# Altium schematic sheet MCU.SchDoc
size A4; SheetNumber: 3; SheetTotal: 3
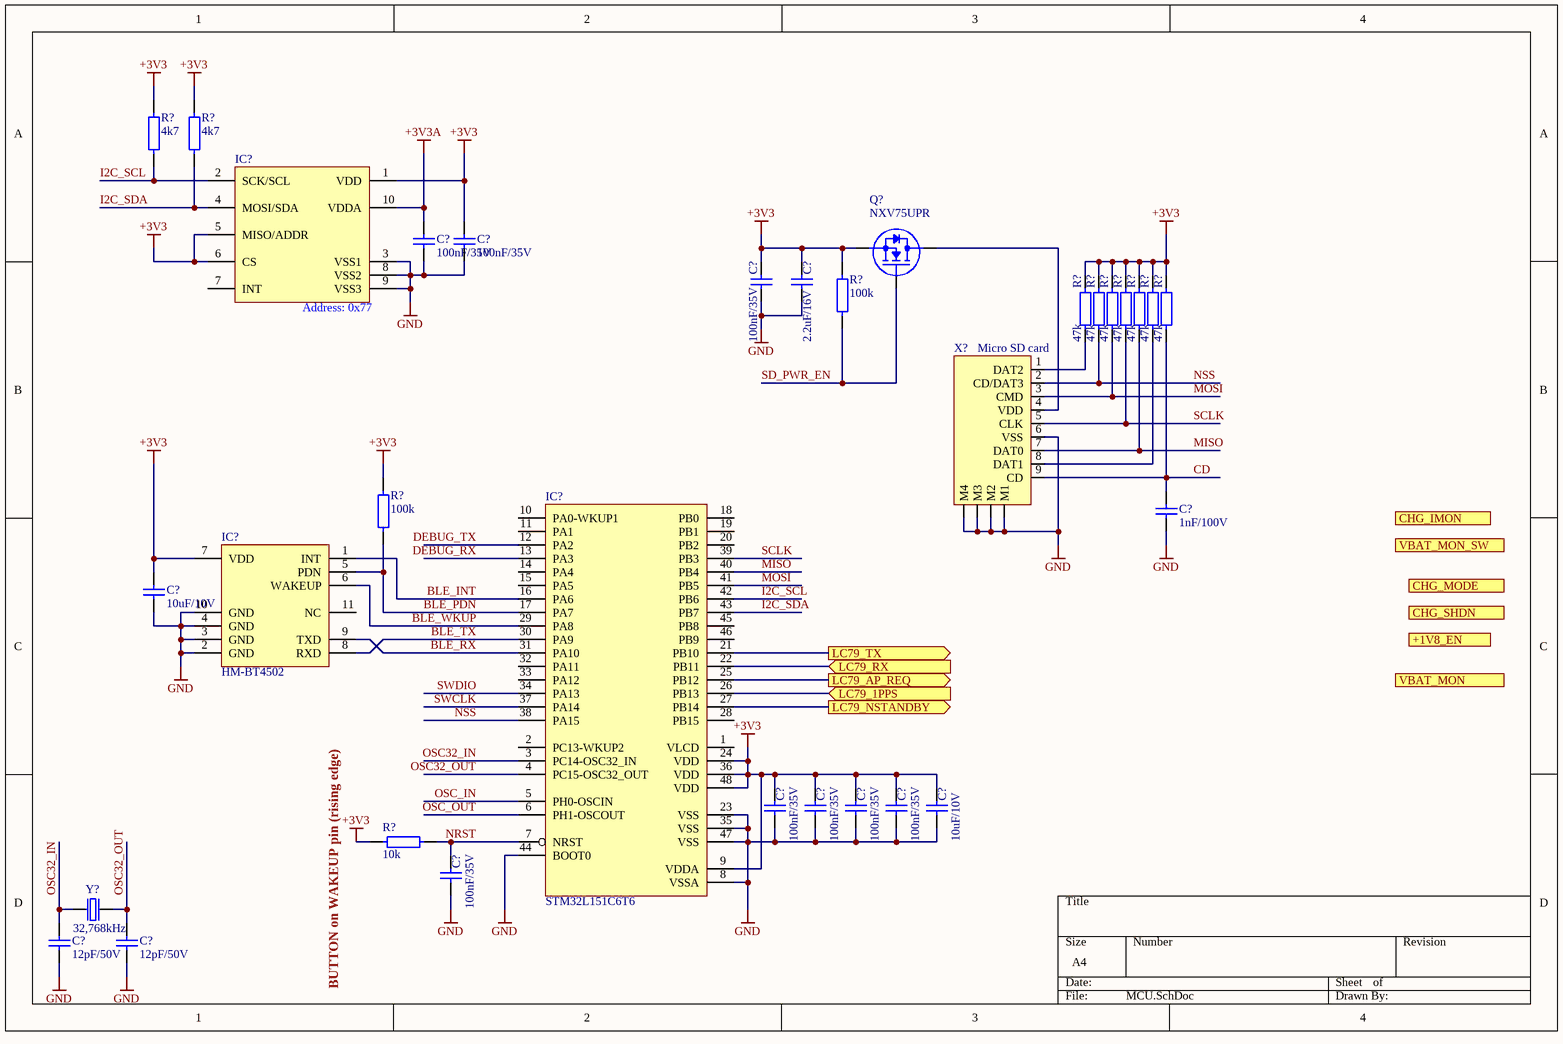
[diagram p0: MCU.SchDoc]

## Parts
(Parts that share a designator on the sheet are numbered #1, #2 ... from top to bottom, then left to right.)
C?#1  100nF/35V  [C0603]
C?#2  100nF/35V  [C0603]
C?#3  100nF/35V  [C0603]
C?#4  2.2uF/16V  [C0603]
C?#5  1nF/100V  [C0603]
C?#6  10uF/10V  [C0603]
C?#7  100nF/35V  [C0603]
C?#8  100nF/35V  [C0603]
C?#9  100nF/35V  [C0603]
C?#10  100nF/35V  [C0603]
C?#11  10uF/10V  [C0603]
C?#12  100nF/35V  [C0603]
C?#13  12pF/50V  [C0603]
C?#14  12pF/50V  [C0603]
IC?#1  (no value)  [LGA10]
IC?#2  STM32L151C6T6  [LQFP48]
IC?#3  HM-BT4502  [HM-BT450X]
Q?  NXV75UPR  [SOT23-3]
R?#1  4k7  [R0603]
R?#2  4k7  [R0603]
R?#3  100k  [R0603]
R?#4  47k  [R0603]
R?#5  47k  [R0603]
R?#6  47k  [R0603]
R?#7  47k  [R0603]
R?#8  47k  [R0603]
R?#9  47k  [R0603]
R?#10  47k  [R0603]
R?#11  100k  [R0603]
R?#12  10k  [r0603]
X?  Micro SD card  [MicroSD pull-slot]
Y?  32,768kHz  [FC135]

## Ports
+1V8_EN (in), CHG_IMON (out), CHG_MODE (out), CHG_SHDN (in), LC79_1PPS (in), LC79_AP_REQ (out), LC79_NSTANDBY (out), LC79_RX (in), LC79_TX (out), VBAT_MON (out), VBAT_MON_SW (in)

## Nets
+3V3: C?#2.2 C?#3.2 C?#4.2 C?#6.2 C?#7.2 C?#8.2 C?#9.2 C?#10.2 C?#11.2 IC?#1.1(VDD) IC?#1.5(MISO/ADDR) IC?#1.6(CS) IC?#2.9(VDDA) IC?#2.24(VDD) IC?#2.36(VDD) IC?#2.48(VDD) IC?#3.7(VDD) Q?.2(S) R?#1.1 R?#2.1 R?#3.1 R?#4.2 R?#5.2 R?#6.2 R?#7.2 R?#8.2 R?#9.2 R?#10.2 R?#11.2 R?#12.1
+3V3A: C?#1.2 IC?#1.10(VDDA)
GND: C?#1.1 C?#2.1 C?#3.1 C?#4.1 C?#5.1 C?#6.1 C?#7.1 C?#8.1 C?#9.1 C?#10.1 C?#11.1 C?#12.1 C?#13.1 C?#14.1 IC?#1.3(VSS1) IC?#1.8(VSS2) IC?#1.9(VSS3) IC?#2.8(VSSA) IC?#2.23(VSS) IC?#2.35(VSS) IC?#2.44(BOOT0) IC?#2.47(VSS) IC?#3.2(GND) IC?#3.3(GND) IC?#3.4(GND) IC?#3.10(GND) X?.6(VSS) X?.M1 X?.M2 X?.M3 X?.M4
BLE_INT: IC?#2.16(PA6) IC?#3.1(INT)
BLE_PDN: IC?#2.17(PA7) IC?#3.5(PDN) R?#11.1
BLE_RX: IC?#2.31(PA10) IC?#3.9(TXD)
BLE_TX: IC?#2.30(PA9) IC?#3.8(RXD)
BLE_WKUP: IC?#2.29(PA8) IC?#3.6(WAKEUP)
CD: C?#5.2 R?#10.1 X?.9(CD)
DEBUG_RX: IC?#2.13(PA3)
DEBUG_TX: IC?#2.12(PA2)
I2C_SCL: IC?#1.2(SCK/SCL) IC?#2.42(PB6) R?#1.2
I2C_SDA: IC?#1.4(MOSI/SDA) IC?#2.43(PB7) R?#2.2
LC79_1PPS: IC?#2.26(PB13) ; port LC79_1PPS
LC79_AP_REQ: IC?#2.25(PB12) ; port LC79_AP_REQ
LC79_NSTANDBY: IC?#2.27(PB14) ; port LC79_NSTANDBY
LC79_RX: IC?#2.22(PB11) ; port LC79_RX
LC79_TX: IC?#2.21(PB10) ; port LC79_TX
MISO: IC?#2.40(PB4) R?#8.1 X?.7(DAT0)
MOSI: IC?#2.41(PB5) R?#6.1 X?.3(CMD)
NRST: C?#12.2 IC?#2.7(NRST) R?#12.2
NSS: IC?#2.38(PA15) R?#5.1 X?.2(CD/DAT3)
OSC32_IN: C?#13.2 IC?#2.3(PC14-OSC32_IN) Y?.1
OSC32_OUT: C?#14.2 IC?#2.4(PC15-OSC32_OUT) Y?.2
OSC_IN: IC?#2.5(PH0-OSCIN)
OSC_OUT: IC?#2.6(PH1-OSCOUT)
SCLK: IC?#2.39(PB3) R?#7.1 X?.5(CLK)
SD_PWR_EN: Q?.1(G) R?#3.2
SWCLK: IC?#2.37(PA14)
SWDIO: IC?#2.34(PA13)
NetQ?_3: Q?.3(D) X?.4(VDD)
NetR?#4_1: R?#4.1 X?.1(DAT2)
NetR?#9_1: R?#9.1 X?.8(DAT1)

Not connected (* = marked no-connect by the designer): IC?#1 7(INT); IC?#2 1(VLCD) 2(PC13-WKUP2) 10(PA0-WKUP1) 11(PA1) 14(PA4) 15(PA5) 18(PB0) 19(PB1) 20(PB2) 28(PB15) 32(PA11) 33(PA12) 45(PB8) 46(PB9); IC?#3 11(NC)

## Notes on the sheet
- (near IC?#1) Address: 0x77
- (near R?#12) BUTTON on WAKEUP pin (rising edge)

## Library data of the parts
C?#1-C?#3 C?#7-C?#10 C?#12 = 06035G104ZAT2A: CERAMIC CAPACITOR, 0.1UF, 50V, Y5V, +80,-20%, 0603, FULL REEL; Product Range:-; Capacitance:0.1 F; Capacitance Tolerance:+80%, -20%; Dielectric Characteristic:Y5V; Voltage Rating:50V; Ceramic Capacitor Case:0603 [1608 Metric] ;RoHS Compliant: Yes; Manufacturer: Kyocera AVX; Capacitance: 100nF; Tolerance: 80%; Supplier 1: Farnell; Supplier Part Number 1: 2332660; Manufacturer Part Number: 06035G104ZAT2A; RoHS: Yes; Category: Ceramic Capacitors; Stock 1: 29140; Pricing 1: 10=0,03250, 100=0,02120, 500=0,01780, 1000=0,01420, 2000=0,01220 (GBP); Mount: Surface Mount,PCB; Case/Package: 0603; Number of Pins: 2; Case Code (Metric): 1608; Case Code (Imperial): 0603; Contact Plating: Tin,Matte; Dielectric Material: Ceramic; Min Operating Temperature: -30°C; Max Operating Temperature: 85°C; Dielectric: Y5V; Packaging: Tape and Reel; Voltage Rating (DC): 50V; Voltage Rating: 50V; Package Quantity: 1; Termination: SMD/SMT; Voltage: 50V; Series: -; Construction: Flat; Length: 1.6mm; Width: 0.032inch; Height: 0.63mm; Depth: 0.81mm; Thickness: 0.035inch; Radiation Hardening: No; REACH SVHC: No SVHC; Lead Free: Lead Free; RoHS Compliant: Yes; ComponentLink1URL: https://datasheet.ciiva.com/2987/cy5v-2987860.pdf?src-supplier=Avnet; ComponentLink1Description: https://datasheet.ciiva.com/2987/cy5v-2987860.pdf?src-supplier=Avnet; ComponentLink2URL: https://datasheet.ciiva.com/16359/cy5v-16359895.pdf?src-supplier=Future+Electronics; ComponentLink2Description: https://datasheet.ciiva.com/16359/cy5v-16359895.pdf?src-supplier=Future+Electronics; ComponentLink3URL: https://datasheet.ciiva.com/28613/578190-28613048.pdf?src-supplier=Element14; ComponentLink3Description: https://datasheet.ciiva.com/28613/578190-28613048.pdf?src-supplier=Element14; ComponentLink4URL: https://datasheet.ciiva.com/151/cy5v-151545.pdf?src-supplier=Digi-Key; ComponentLink4Description: https://datasheet.ciiva.com/151/cy5v-151545.pdf?src-supplier=Digi-Key; ComponentLink5URL: https://datasheet.ciiva.com/151/cy5v-151546.pdf?src-supplier=Digi-Key; ComponentLink5Description: https://datasheet.ciiva.com/151/cy5v-151546.pdf?src-supplier=Digi-Key; ComponentLink6URL: https://datasheet.ciiva.com/151/cy5v-151547.pdf?src-supplier=Digi-Key; ComponentLink6Description: https://datasheet.ciiva.com/151/cy5v-151547.pdf?src-supplier=Digi-Key; ComponentLink7URL: https://datasheet.ciiva.com/11499/cy5v-11499710.pdf?src-supplier=Avnet; ComponentLink7Description: https://datasheet.ciiva.com/11499/cy5v-11499710.pdf?src-supplier=Avnet; Supplier 2: Mouser; Supplier Part Number 2: 581-06035G104Z; Stock 2: 97036; Pricing 2: 1=0,09000, 10=0,03300, 50=0,03300, 100=0,02700, 1000=0,01600, 10000=0,01000 (USD); Supplier 3: Digi-Key; Supplier Part Number 3: 478-3724-6-ND; Stock 3: 629269; Pricing 3: 1=0,10000, 10=0,05900, 50=0,03220, 100=0,02640, 500=0,01882, 1000=0,01479 (USD)
C?#4 = C1608X5R1C225K080AB: TDK - C1608X5R1C225K080AB - SMD Multilayer Ceramic Capacitor, 2.2 µF, 16 V, 0603 [1608 Metric], ± 10%, X5R, C Series TDK; Capacitance: 2.2uF; Voltage Rating: 16V; Manufacturer: TDK; Manufacturer Part Number: C1608X5R1C225K080AB; RoHS: Yes; Category: Ceramic Capacitors; Stock 1: 107257; Pricing 1: 1=0,19000, 10=0,12900, 50=0,07760, 100=0,06560, 500=0,04484, 1000=0,03968 (USD); Mount: Surface Mount; Case/Package: 0603; Case Code (Metric): 1608; Case Code (Imperial): 0603; Dielectric Material: Ceramic; Weight: 7.1E-05oz; Min Operating Temperature: -55°C; Max Operating Temperature: 85°C; Tolerance: 10%; Dielectric: X5R; Packaging: Tape and Reel; Voltage Rating (DC): 16V; Termination: SMD/SMT; Package Quantity: 1; Resistor Type: Ceramic; Construction: Flat; Voltage: 16V; Series: C; Length: 1.6mm; Width: 0.031inch; Height: 0.8mm; Depth: 0.8mm; Thickness: 0.035inch; Radiation Hardening: No; REACH SVHC: No SVHC; Lead Free: Lead Free; RoHS Compliant: Yes; ComponentLink1URL: https://datasheet.ciiva.com/6251/tdkmlcccaprange-6251142.pdf?src-supplier=Digi-Key; ComponentLink1Description: https://datasheet.ciiva.com/6251/tdkmlcccaprange-6251142.pdf?src-supplier=Digi-Key; ComponentLink2URL: https://datasheet.ciiva.com/28577/mlcc-commercial-general-en-28577144.pdf?src-supplier=Element14; ComponentLink2Description: https://datasheet.ciiva.com/28577/mlcc-commercial-general-en-28577144.pdf?src-supplier=Element14; ComponentLink3URL: https://datasheet.ciiva.com/26285/13mlcc-commercial-general-en-26285227.pdf?src-supplier=Onlinecomponents.com; ComponentLink3Description: https://datasheet.ciiva.com/26285/13mlcc-commercial-general-en-26285227.pdf?src-supplier=Onlinecomponents.com; ComponentLink4URL: https://datasheet.ciiva.com/22725/1913358-22725516.pdf?src-supplier=Element14; ComponentLink4Description: https://datasheet.ciiva.com/22725/1913358-22725516.pdf?src-supplier=Element14; ComponentLink5URL: https://datasheet.ciiva.com/17487/e412-c-17487517.pdf?src-supplier=Avnet+Europe; ComponentLink5Description: https://datasheet.ciiva.com/17487/e412-c-17487517.pdf?src-supplier=Avnet+Europe; ComponentLink6URL: https://datasheet.ciiva.com/23802/1796654-23802766.pdf?src-supplier=Newark; ComponentLink6Description: https://datasheet.ciiva.com/23802/1796654-23802766.pdf?src-supplier=Newark; ComponentLink7URL: https://datasheet.ciiva.com/7975/1796654-7975071.pdf?src-supplier=Element14; ComponentLink7Description: https://datasheet.ciiva.com/7975/1796654-7975071.pdf?src-supplier=Element14; Supplier 1: Digi-Key; Supplier 2: Mouser; Supplier 3: Farnell; Supplier Part Number 1: 445-5157-1-ND; Supplier Part Number 2: 810-C1608X5R1C225K-4; Supplier Part Number 3: 2211169
C?#5 = 06031C102KAT2A: Cap MLCC SMD 0603 100V X7R 1000pF 10% Commercial Ti/Sn Plated 7"T/R; Manufacturer: Kyocera AVX; Dielectric Material: Ceramic; Capacitance: 1nF; Insulation Resistance: 100GR; Dissipation Factor: 2.5%; Supplier 1: Farnell; Supplier Part Number 1: 1833874; Manufacturer Part Number: 06031C102KAT2A; RoHS: Yes; Category: Ceramic Capacitors; Stock 1: 21717; Pricing 1: 10=0,05170, 100=0,04240, 500=0,02740, 1000=0,02080, 2000=0,01750, 4000=0,01420, 20000=0,01240 (GBP); Mount: Surface Mount,PCB; Case/Package: 0603; Number of Pins: 2; Case Code (Imperial): 0603; Case Code (Metric): 1608; Contact Plating: Tin,Matte; Min Operating Temperature: -55°C; Max Operating Temperature: 125°C; Tolerance: 10%; Dielectric: X7R; Packaging: Tape and Reel; Voltage Rating (DC): 100V; Voltage Rating: 100V; Package Quantity: 1; Termination: SMD/SMT; Voltage: 100V; Length: 1.6mm; Width: 0.81mm; Height: 0.9mm; Depth: 0.81mm; Thickness: 0.035inch; Radiation Hardening: No; REACH SVHC: No SVHC; Lead Free: Lead Free; ComponentLink1URL: https://datasheet.ciiva.com/2987/cx7r-2987733.pdf?src-supplier=Avnet; ComponentLink1Description: https://datasheet.ciiva.com/2987/cx7r-2987733.pdf?src-supplier=Avnet; ComponentLink2URL: https://datasheet.ciiva.com/7855/84526-7855189.pdf?src-supplier=Element14; ComponentLink2Description: https://datasheet.ciiva.com/7855/84526-7855189.pdf?src-supplier=Element14; ComponentLink3URL: https://datasheet.ciiva.com/11499/cx7r-11499669.pdf?src-supplier=Avnet; ComponentLink3Description: https://datasheet.ciiva.com/11499/cx7r-11499669.pdf?src-supplier=Avnet; ComponentLink4URL: https://datasheet.ciiva.com/1124/1679506-1124198.pdf?src-supplier=Element14; ComponentLink4Description: https://datasheet.ciiva.com/1124/1679506-1124198.pdf?src-supplier=Element14; ComponentLink5URL: https://datasheet.ciiva.com/16289/cx7r-16289400.pdf?src-supplier=Future+Electronics; ComponentLink5Description: https://datasheet.ciiva.com/16289/cx7r-16289400.pdf?src-supplier=Future+Electronics; ComponentLink6URL: https://datasheet.ciiva.com/5422/cx7r-218113-5422905.pdf?src-supplier=Mouser; ComponentLink6Description: https://datasheet.ciiva.com/5422/cx7r-218113-5422905.pdf?src-supplier=Mouser; ComponentLink7URL: https://datasheet.ciiva.com/7855/1679506-7855033.pdf?src-supplier=Element14; ComponentLink7Description: https://datasheet.ciiva.com/7855/1679506-7855033.pdf?src-supplier=Element14; ComponentLink8URL: https://datasheet.ciiva.com/150/cx7r-150395.pdf?src-supplier=Digi-Key; ComponentLink8Description: https://datasheet.ciiva.com/150/cx7r-150395.pdf?src-supplier=Digi-Key; ComponentLink9URL: https://datasheet.ciiva.com/22693/1679506-22693579.pdf?src-supplier=Element14; ComponentLink9Description: https://datasheet.ciiva.com/22693/1679506-22693579.pdf?src-supplier=Element14; ComponentLink10URL: https://datasheet.ciiva.com/150/cx7r-150396.pdf?src-supplier=Digi-Key; ComponentLink10Description: https://datasheet.ciiva.com/150/cx7r-150396.pdf?src-supplier=Digi-Key; ComponentLink11URL: https://datasheet.ciiva.com/14600/70001075-14600988.pdf?src-supplier=Allied+Electronics; ComponentLink11Description: https://datasheet.ciiva.com/14600/70001075-14600988.pdf?src-supplier=Allied+Electronics; ComponentLink12URL: https://datasheet.ciiva.com/150/cx7r-150397.pdf?src-supplier=Digi-Key; ComponentLink12Description: https://datasheet.ciiva.com/150/cx7r-150397.pdf?src-supplier=Digi-Key; ComponentLink13URL: https://datasheet.ciiva.com/14594/70001075-14594623.pdf?src-supplier=Allied+Electronics; ComponentLink13Description: https://datasheet.ciiva.com/14594/70001075-14594623.pdf?src-supplier=Allied+Electronics; ComponentLink14URL: https://datasheet.ciiva.com/16484/cx7r-16484383.pdf?src-supplier=Avnet+Asia; ComponentLink14Description: https://datasheet.ciiva.com/16484/cx7r-16484383.pdf?src-supplier=Avnet+Asia
C?#6 C?#11 = LMK107BBJ106MALT: TAIYO YUDEN - LMK107BBJ106MALT - CAPACITOR, MLCC, X5R, 10UF, 10V, 0603, REEL, FULL REEL; Tolerance: 20%; Supplier 1: Farnell; Supplier Part Number 1: 2113070; Manufacturer: Taiyo Yuden; Manufacturer Part Number: LMK107BBJ106MALT; RoHS: Yes; Category: Ceramic Capacitors; Stock 1: 9135; Pricing 1: 10=0,08050, 100=0,04970, 500=0,03510, 1000=0,03060, 2000=0,02970, 4000=0,02430, 20000=0,01840 (GBP); Mount: Surface Mount; Case/Package: 0603; Case Code (Imperial): 0603; Case Code (Metric): 1608; Min Operating Temperature: -55°C; Max Operating Temperature: 85°C; Termination: SMD/SMT; Resistor Type: Ceramic; Package Quantity: 1; Voltage Rating: 10V; Voltage Rating (DC): 10V; Packaging: Tape and Reel; Capacitance: 10uF; Dielectric: X5R; Voltage: 10V; Length: 1.6mm; Width: 0.8mm; Height: 0.8mm; Thickness: 0.035inch; Depth: 0.8mm; Radiation Hardening: No; REACH SVHC: Unknown; Lead Free: Lead Free; ComponentLink1URL: https://datasheet.ciiva.com/11596/lmk107bbj106malt-ss-11596989.pdf?src-supplier=Avnet; ComponentLink1Description: https://datasheet.ciiva.com/11596/lmk107bbj106malt-ss-11596989.pdf?src-supplier=Avnet; ComponentLink2URL: https://datasheet.ciiva.com/26872/getdatasheetpartid-637524-26872634.pdf?src-supplier=Verical; ComponentLink2Description: https://datasheet.ciiva.com/26872/getdatasheetpartid-637524-26872634.pdf?src-supplier=Verical
C?#13 C?#14 = C0603C120J5GACTU: Capacitor; Ceramic; Cap; 12.0pF; Tol 5%; SMT; Vol-Rtg 50V; C0G; Manufacturer: KEMET; Capacitance: 12pF; Temperature Coefficient: 30ppm/°C; Supplier 1: Digi-Key; Manufacturer Part Number: C0603C120J5GACTU; RoHS: Yes; Category: Ceramic Capacitors; Stock 1: 65599; Pricing 1: 1=0,10000, 10=0,05600, 50=0,03040, 100=0,02480, 500=0,01772, 1000=0,01392 (USD); Mount: Surface Mount,PCB; Case/Package: 0603; Number of Pins: 2; Dielectric Material: Ceramic; Contact Material: Tin; Case Code (Imperial): 0603; Case Code (Metric): 1608; Weight: 7.1E-05oz; Min Operating Temperature: -55°C; Max Operating Temperature: 125°C; Tolerance: 5%; Packaging: Tape and Reel; Dielectric: C0G; Voltage: 50V; Termination: SMD/SMT; Voltage Rating (DC): 50V; Package Quantity: 1; Series: C; Voltage Rating: 50V; Construction: Flat; Length: 1.6mm; Width: 0.8mm; Height: 0.8mm; Depth: 0.8mm; Thickness: 0.034inch; Lead Pitch: 0.7mm; Radiation Hardening: No; Lead Free: Lead Free; REACH SVHC: No SVHC; ComponentLink1URL: https://datasheet.ciiva.com/28608/1372242-28608539.pdf?src-supplier=Element14; ComponentLink1Description: https://datasheet.ciiva.com/28608/1372242-28608539.pdf?src-supplier=Element14; Supplier 2: Mouser; Supplier 3: Farnell; Supplier 4: TME; Supplier Part Number 1: 399-1050-1-ND; Supplier Part Number 2: 80-C0603C120J5G; Supplier Part Number 3: 1414612; Supplier Part Number 4: C0603C120J5GAC
IC?#1 = BMP384: Board Mount Absolute Pressure Sensor, LGA10; Manufacturer: Bosch Tools; Supplier 1: Mouser; Manufacturer Part Number: BMP384; RoHS: No; Stock 1: 11593; Pricing 1: 1=4,49000, 10=3,97000, 25=3,22000, 50=2,85000, 100=2,77000, 500=2,61000, 1000=2,53000, 10000=1,85000 (USD); Supplier 2: Digi-Key; Supplier Part Number 1: 262-BMP384; Supplier Part Number 2: 828-BMP384CT-ND
IC?#2 = STM32L151C6T6: STMICROELECTRONICS - STM32L151C6T6 - MCU, 32BIT, CORTEX-M3, 32MHZ, LQFP-48; Interface: I2C,SPI,USB,IrDA,UART,USART,LIN; Number of I/Os: 37; Oscillator Type: Internal; Memory Type: FLASH; Memory Size: 32KB; Peripherals: Brown-out Detect/Reset,POR,PWM,WDT,DMA,I2C; Core Architecture: ARM; RAM Size: 10KB; Max Supply Voltage: 3.6V; Min Supply Voltage: 1.65V; Number of Timers/Counters: 8; Data Bus Width: 32b; Watchdog Timer: Yes; Max Power Dissipation: 339mW; Number of PWM Channels: 1; Number of ADC Channels: 14; Number of SPI Channels: 2; Supplier 1: Mouser; Manufacturer: STMicroelectronics; Manufacturer Part Number: STM32L151C6T6; RoHS: Yes; Category: Microcontrollers; Pricing 1: 1=4,76000, 10=4,28000, 50=4,05000, 100=3,51000, 1000=2,52000, 10000=2,39000 (USD); Case/Package: LQFP; Number of Pins: 48; Min Operating Temperature: -40°C; Max Operating Temperature: 85°C; Frequency: 32MHz; Packaging: Tray; Package Quantity: 250; Number of Programmable I/O: 37; Max Frequency: 32MHz; Series: STM32 L1; Number of USB Channels: 1; Number of I2C Channels: 2; Length: 9.2mm; Width: 9.2mm; Height: 1.45mm; Radiation Hardening: No; RoHS Compliant: Yes; REACH SVHC: No SVHC; Lead Free: Lead Free; ComponentLink1URL: https://datasheet.ciiva.com/16490/cd00277537-16490959.pdf?src-supplier=Future+Electronics; ComponentLink1Description: https://datasheet.ciiva.com/16490/cd00277537-16490959.pdf?src-supplier=Future+Electronics; ComponentLink2URL: https://datasheet.ciiva.com/48688/001075537-da-01-en-mcu-32bt-32kb-stm32l151c6t6-lqfp-48-stm-48688197.pdf?src-supplier=Conrad; ComponentLink2Description: https://datasheet.ciiva.com/48688/001075537-da-01-en-mcu-32bt-32kb-stm32l151c6t6-lqfp-48-stm-48688197.pdf?src-supplier=Conrad; Supplier 2: Farnell; Supplier 3: TME; Supplier Part Number 1: 511-STM32L151C6T6; Supplier Part Number 2: 2060921; Supplier Part Number 3: STM32L151C6T6
IC?#3 = HM-BT4502: Bluetooth Low Energy (Pass through Module); Manufacturer: HopeRF; Supplier 1: SOS electronic; Manufacturer Part Number: HM-BT4502; RoHS: No; Stock 1: 12; Pricing 1: 1=2,05000, 2=2,00000, 5=1,94000, 64=1,79000, 128=1,76000 (EUR); Supplier Part Number 1: HM-BT4502
Q? = NXV75UPR: Transistor MOSFET P-Channel 20V 1.8A 3-pin SOT-23; Manufacturer: Nexperia; Supplier 1: Farnell; Manufacturer Part Number: NXV75UPR; RoHS: No; Pricing 1: 5=0,39200, 10=0,30500, 100=0,17400, 500=0,11500 (GBP); Supplier 2: Mouser; Supplier 3: Digi-Key; Supplier Part Number 1: 3617844; Supplier Part Number 2: 771-NXV75UPR; Supplier Part Number 3: 1727-NXV75UPRCT-ND
R?#1 R?#2 = CR0603-FX-4701ELF: BOURNS - CR0603-FX-4701ELF - RES, 4K7, 1%, 0.1W, 0603, THICK FILM; Resistance: 4.7kR; Temperature Coefficient: 100ppm/°C; Power Rating: 100mW; Voltage Rating: 50V; Manufacturer: Bourns; Manufacturer Part Number: CR0603-FX-4701ELF; RoHS: Yes; Category: Chip SMD Resistors; Stock 1: 118416; Pricing 1: 1=0,10000, 10=0,01700, 100=0,00680, 1000=0,00305, 2500=0,00264 (USD); Mount: Surface Mount; Case/Package: 0603; Number of Pins: 2; Contact Plating: Tin; Case Code (Metric): 1608; Case Code (Imperial): 0603; Min Operating Temperature: -55°C; Max Operating Temperature: 155°C; Tolerance: 1%; Resistor Type: Thick Film; Package Quantity: 1; Packaging: Tape and Reel; Number of Terminations: 2; Termination: SMD/SMT; Max Power Dissipation: 100mW; Voltage Rating (DC): 50V; Features: Moisture Resistant; Series: CR0603; Resistance Tolerance: 1%; Technology: THICK FILM; Length: 1.6mm; Width: 0.8mm; Height: 0.45mm; Depth: 0.8mm; Thickness: 457um; Radiation Hardening: No; REACH SVHC: No SVHC; RoHS Compliant: Yes; ComponentLink1URL: https://datasheet.ciiva.com/11810/0900766b80fcdb72-11810558.pdf?src-supplier=RSComponents; ComponentLink1Description: https://datasheet.ciiva.com/11810/0900766b80fcdb72-11810558.pdf?src-supplier=RSComponents; ComponentLink2URL: https://datasheet.ciiva.com/22734/1902866-22734169.pdf?src-supplier=Element14; ComponentLink2Description: https://datasheet.ciiva.com/22734/1902866-22734169.pdf?src-supplier=Element14; ComponentLink3URL: https://datasheet.ciiva.com/7986/1856384-7986170.pdf?src-supplier=Element14; ComponentLink3Description: https://datasheet.ciiva.com/7986/1856384-7986170.pdf?src-supplier=Element14; ComponentLink4URL: https://datasheet.ciiva.com/7660/1856384-7660955.pdf?src-supplier=Element14; ComponentLink4Description: https://datasheet.ciiva.com/7660/1856384-7660955.pdf?src-supplier=Element14; Supplier 1: Digi-Key; Supplier 2: Mouser; Supplier 3: Farnell; Supplier Part Number 1: CR0603-FX-4701ELFCT-ND; Supplier Part Number 2: 652-CR0603FX-4701ELF; Supplier Part Number 3: 2008340
R?#3 R?#11 = CR0603-FX-1003ELF: Bourns CR0603-FX Series Thick Film Surface Mount Fixed Resistor 0603 Case 100k 1% 0.1W 100ppm/C; Temperature Coefficient: 100ppm/°C; Resistance: 100kR; Voltage Rating (DC): 50V; Max Power Dissipation: 100mW; Manufacturer: Bourns; Manufacturer Part Number: CR0603-FX-1003ELF; RoHS: Yes; Category: Chip SMD Resistors; Stock 1: 282; Pricing 1: 1=0,10000, 10=0,01700, 100=0,00680, 1000=0,00305, 2500=0,00264 (USD); Mount: Surface Mount; Case/Package: 0603; Number of Pins: 2; Contact Plating: Tin; Case Code (Metric): 1608; Case Code (Imperial): 0603; Min Operating Temperature: -55°C; Max Operating Temperature: 155°C; Resistor Type: Thick Film; Tolerance: 1%; Number of Terminations: 2; Termination: SMD/SMT; Features: Moisture Resistant; Packaging: Tape and Reel; Power Rating: 100mW; Voltage Rating: 50V; Package Quantity: 1; Working Voltage: 50V; Length: 1.6mm; Width: 0.031inch; Height: 0.022inch; Depth: 0.8mm; Thickness: 457um; Radiation Hardening: No; REACH SVHC: No SVHC; Military Standard: Not; ComponentLink1URL: https://datasheet.ciiva.com/11808/0900766b80fcdb72-11808036.pdf?src-supplier=RSComponents; ComponentLink1Description: https://datasheet.ciiva.com/11808/0900766b80fcdb72-11808036.pdf?src-supplier=RSComponents; ComponentLink2URL: https://datasheet.ciiva.com/19466/1163741-19466516.pdf?src-supplier=Jameco; ComponentLink2Description: https://datasheet.ciiva.com/19466/1163741-19466516.pdf?src-supplier=Jameco; ComponentLink3URL: https://datasheet.ciiva.com/41449/001055485-da-01-en-smd-wid-cr0603-fx-1003elf-100k-ohm-1-10w-41449971.pdf?src-supplier=Conrad; ComponentLink3Description: https://datasheet.ciiva.com/41449/001055485-da-01-en-smd-wid-cr0603-fx-1003elf-100k-ohm-1-10w-41449971.pdf?src-supplier=Conrad; ComponentLink4URL: https://datasheet.ciiva.com/46385/691949-46385260.pdf?src-supplier=Element14; ComponentLink4Description: https://datasheet.ciiva.com/46385/691949-46385260.pdf?src-supplier=Element14; ComponentLink5URL: https://datasheet.ciiva.com/6547/chpreztr-6547309.pdf?src-supplier=Digi-Key; ComponentLink5Description: https://datasheet.ciiva.com/6547/chpreztr-6547309.pdf?src-supplier=Digi-Key; ComponentLink6URL: https://datasheet.ciiva.com/6547/chpreztr-6547310.pdf?src-supplier=Digi-Key; ComponentLink6Description: https://datasheet.ciiva.com/6547/chpreztr-6547310.pdf?src-supplier=Digi-Key; ComponentLink7URL: https://datasheet.ciiva.com/3255/chpreztr-3255919.pdf?src-supplier=Avnet; ComponentLink7Description: https://datasheet.ciiva.com/3255/chpreztr-3255919.pdf?src-supplier=Avnet; ComponentLink8URL: https://datasheet.ciiva.com/16782/70154685-16782911.pdf?src-supplier=Allied+Electronics; ComponentLink8Description: https://datasheet.ciiva.com/16782/70154685-16782911.pdf?src-supplier=Allied+Electronics; ComponentLink9URL: https://datasheet.ciiva.com/22693/1902866-22693207.pdf?src-supplier=Element14; ComponentLink9Description: https://datasheet.ciiva.com/22693/1902866-22693207.pdf?src-supplier=Element14; ComponentLink10URL: https://datasheet.ciiva.com/16941/chpreztr-16941643.pdf?src-supplier=Avnet+Europe; ComponentLink10Description: https://datasheet.ciiva.com/16941/chpreztr-16941643.pdf?src-supplier=Avnet+Europe; ComponentLink11URL: https://datasheet.ciiva.com/15159/getdatasheetpartid-57636-15159629.pdf?src-supplier=Verical; ComponentLink11Description: https://datasheet.ciiva.com/15159/getdatasheetpartid-57636-15159629.pdf?src-supplier=Verical; ComponentLink12URL: https://datasheet.ciiva.com/5546/chpreztr-5546894.pdf?src-supplier=Mouser; ComponentLink12Description: https://datasheet.ciiva.com/5546/chpreztr-5546894.pdf?src-supplier=Mouser; ComponentLink13URL: https://datasheet.ciiva.com/7986/1902866-7986158.pdf?src-supplier=Element14; ComponentLink13Description: https://datasheet.ciiva.com/7986/1902866-7986158.pdf?src-supplier=Element14; ComponentLink14URL: https://datasheet.ciiva.com/6547/chpreztr-6547311.pdf?src-supplier=Digi-Key; ComponentLink14Description: https://datasheet.ciiva.com/6547/chpreztr-6547311.pdf?src-supplier=Digi-Key; ComponentLink15URL: https://datasheet.ciiva.com/30120/159chpreztr-30120559.pdf?src-supplier=Onlinecomponents.com; ComponentLink15Description: https://datasheet.ciiva.com/30120/159chpreztr-30120559.pdf?src-supplier=Onlinecomponents.com; Supplier 1: Digi-Key; Supplier 2: Mouser; Supplier 3: Farnell; Supplier Part Number 1: CR0603-FX-1003ELFCT-ND; Supplier Part Number 2: 652-CR0603-FX-103ELF; Supplier Part Number 3: 2008342
R?#4-R?#10 = AC0603FR-0747KL: RES SMD 47K OHM 1% 1/10W 0603; Manufacturer: Yageo; Resistance: 47kR; Temperature Coefficient: 100ppm/°C; Power Rating: 100mW; Voltage Rating: 50V; Supplier 1: Mouser; Manufacturer Part Number: AC0603FR-0747KL; RoHS: Yes; Category: Chip SMD Resistors; Stock 1: 18433; Pricing 1: 1=0,10000, 10=0,02900, 50=0,02900, 100=0,01200, 1000=0,00600, 10000=0,00400 (USD); Case/Package: 0603; Contact Plating: Tin,Matte; Case Code (Imperial): 0603; Case Code (Metric): 1608; Weight: 7.1E-05oz; Min Operating Temperature: -55°C; Max Operating Temperature: 155°C; Tolerance: 1%; Resistor Type: Thick Film; Packaging: Tape and Reel; Number of Terminations: 2; Termination: SMD/SMT; Max Power Dissipation: 100mW; Features: Moisture Resistant,Automotive AEC-Q200; Series: AC; Construction: Rectangular; Length: 1.6mm; Width: 0.031inch; Height: 0.022inch; Depth: 0.8mm; Radiation Hardening: No; Military Standard: Not; Lead Free: Lead Free; RoHS Compliant: Yes; ComponentLink1URL: https://datasheet.ciiva.com/26862/getdatasheetpartid-725037-26862466.pdf?src-supplier=Verical; ComponentLink1Description: https://datasheet.ciiva.com/26862/getdatasheetpartid-725037-26862466.pdf?src-supplier=Verical; ComponentLink2URL: https://datasheet.ciiva.com/12576/pyu-ac-51-rohs-l-2-12576783.pdf?src-supplier=Mouser; ComponentLink2Description: https://datasheet.ciiva.com/12576/pyu-ac-51-rohs-l-2-12576783.pdf?src-supplier=Mouser; Supplier Part Number 1: 603-AC0603FR-0747KL
R?#12 = CR0603-FX-1002ELF: Thick Film Resistors 10K 1% 1/10W; Manufacturer: Bourns; Resistance: 10kR; Temperature Coefficient: 100ppm/°C; Power Rating: 100mW; Voltage Rating: 50V; Manufacturer Part Number: CR0603-FX-1002ELF; RoHS: Yes; Category: Chip SMD Resistors; Stock 1: 5832; Pricing 1: 1=0,10000, 10=0,01700, 100=0,00680, 1000=0,00305, 2500=0,00264 (USD); Mount: Surface Mount; Case/Package: 0603; Number of Pins: 2; Contact Plating: Tin; Case Code (Metric): 1608; Case Code (Imperial): 0603; Min Operating Temperature: -55°C; Max Operating Temperature: 155°C; Tolerance: 1%; Resistor Type: Thick Film; Packaging: Tape and Reel; Package Quantity: 5000; Number of Terminations: 2; Termination: SMD/SMT; Max Power Dissipation: 100mW; Voltage Rating (DC): 50V; Features: Moisture Resistant; Series: CR0603; Resistance Tolerance: 1%; Technology: THICK FILM; Construction: Rectangular; Length: 1.6mm; Width: 0.8mm; Height: 0.45mm; Depth: 0.8mm; Thickness: 457um; Radiation Hardening: No; REACH SVHC: No SVHC; Military Standard: Not; RoHS Compliant: Yes; ComponentLink1URL: https://datasheet.ciiva.com/11808/0900766b80fcdb72-11808032.pdf?src-supplier=RSComponents; ComponentLink1Description: https://datasheet.ciiva.com/11808/0900766b80fcdb72-11808032.pdf?src-supplier=RSComponents; ComponentLink2URL: https://datasheet.ciiva.com/27049/774903-27049975.pdf?src-supplier=Jameco; ComponentLink2Description: https://datasheet.ciiva.com/27049/774903-27049975.pdf?src-supplier=Jameco; ComponentLink3URL: https://datasheet.ciiva.com/22693/1902866-22693206.pdf?src-supplier=Element14; ComponentLink3Description: https://datasheet.ciiva.com/22693/1902866-22693206.pdf?src-supplier=Element14; ComponentLink4URL: https://datasheet.ciiva.com/7001/1902866-7001623.pdf?src-supplier=Newark; ComponentLink4Description: https://datasheet.ciiva.com/7001/1902866-7001623.pdf?src-supplier=Newark; ComponentLink5URL: https://datasheet.ciiva.com/16757/70154685-16757483.pdf?src-supplier=Allied+Electronics; ComponentLink5Description: https://datasheet.ciiva.com/16757/70154685-16757483.pdf?src-supplier=Allied+Electronics; ComponentLink6URL: https://datasheet.ciiva.com/22644/1849498-22644171.pdf?src-supplier=Element14; ComponentLink6Description: https://datasheet.ciiva.com/22644/1849498-22644171.pdf?src-supplier=Element14; ComponentLink7URL: https://datasheet.ciiva.com/16938/chpreztr-16938733.pdf?src-supplier=Avnet+Europe; ComponentLink7Description: https://datasheet.ciiva.com/16938/chpreztr-16938733.pdf?src-supplier=Avnet+Europe; ComponentLink8URL: https://datasheet.ciiva.com/3255/chpreztr-3255918.pdf?src-supplier=Avnet; ComponentLink8Description: https://datasheet.ciiva.com/3255/chpreztr-3255918.pdf?src-supplier=Avnet; ComponentLink9URL: https://datasheet.ciiva.com/5548/chpreztr-5548911.pdf?src-supplier=Mouser; ComponentLink9Description: https://datasheet.ciiva.com/5548/chpreztr-5548911.pdf?src-supplier=Mouser; Supplier 1: Digi-Key; Supplier 2: Digi-Key; Supplier 3: Mouser; Supplier Part Number 1: CR0603-FX-1002ELFCT-ND; Supplier Part Number 2: CR0603-FX-1002ELFDKR-ND; Supplier Part Number 3: 652-CR0603FX-1002ELF
X? = SD-Card MICRO: ComponentLink1Description: Datasheet; ComponentLink1URL: https://datasheet.lcsc.com/szlcsc/2009111836_SOFNG-TF-015_C113206.pdf
Y? = Q13FC13500005 FC-135 32.768KHZ 12.5PF: EPSON - Q13FC13500005  FC-135 32.768KHZ 12.5PF - QUARZ, 32.768KHZ, 12.5PF, 3.2 X 2.5MM; Capacitance: 1.25E-11F; Supplier 1: Farnell; Supplier Part Number 1: 2471846; Manufacturer: Epson; Manufacturer Part Number: Q13FC13500005 FC-135 32.768KHZ 12.5PF; RoHS: No; Stock 1: 960; Pricing 1: 1=0,55700, 10=0,39200, 25=0,35100, 50=0,32700, 100=0,31000, 250=0,27900, 1250=0,23400 (GBP); Min Operating Temperature: -40°C; Max Operating Temperature: 85°C; Load Capacitance: 12.5pF; REACH SVHC: Unknown; ComponentLink1URL: http://www.farnell.com/datasheets/1825887.pdf?src-supplier=Farnell; ComponentLink1Description: http://www.farnell.com/datasheets/1825887.pdf?src-supplier=Farnell; ComponentLink2URL: http://www.farnell.com/datasheets/1825887.pdf?src-supplier=Element14; ComponentLink2Description: http://www.farnell.com/datasheets/1825887.pdf?src-supplier=Element14